# Altium schematic sheet turnsig2.SchDoc
size A4
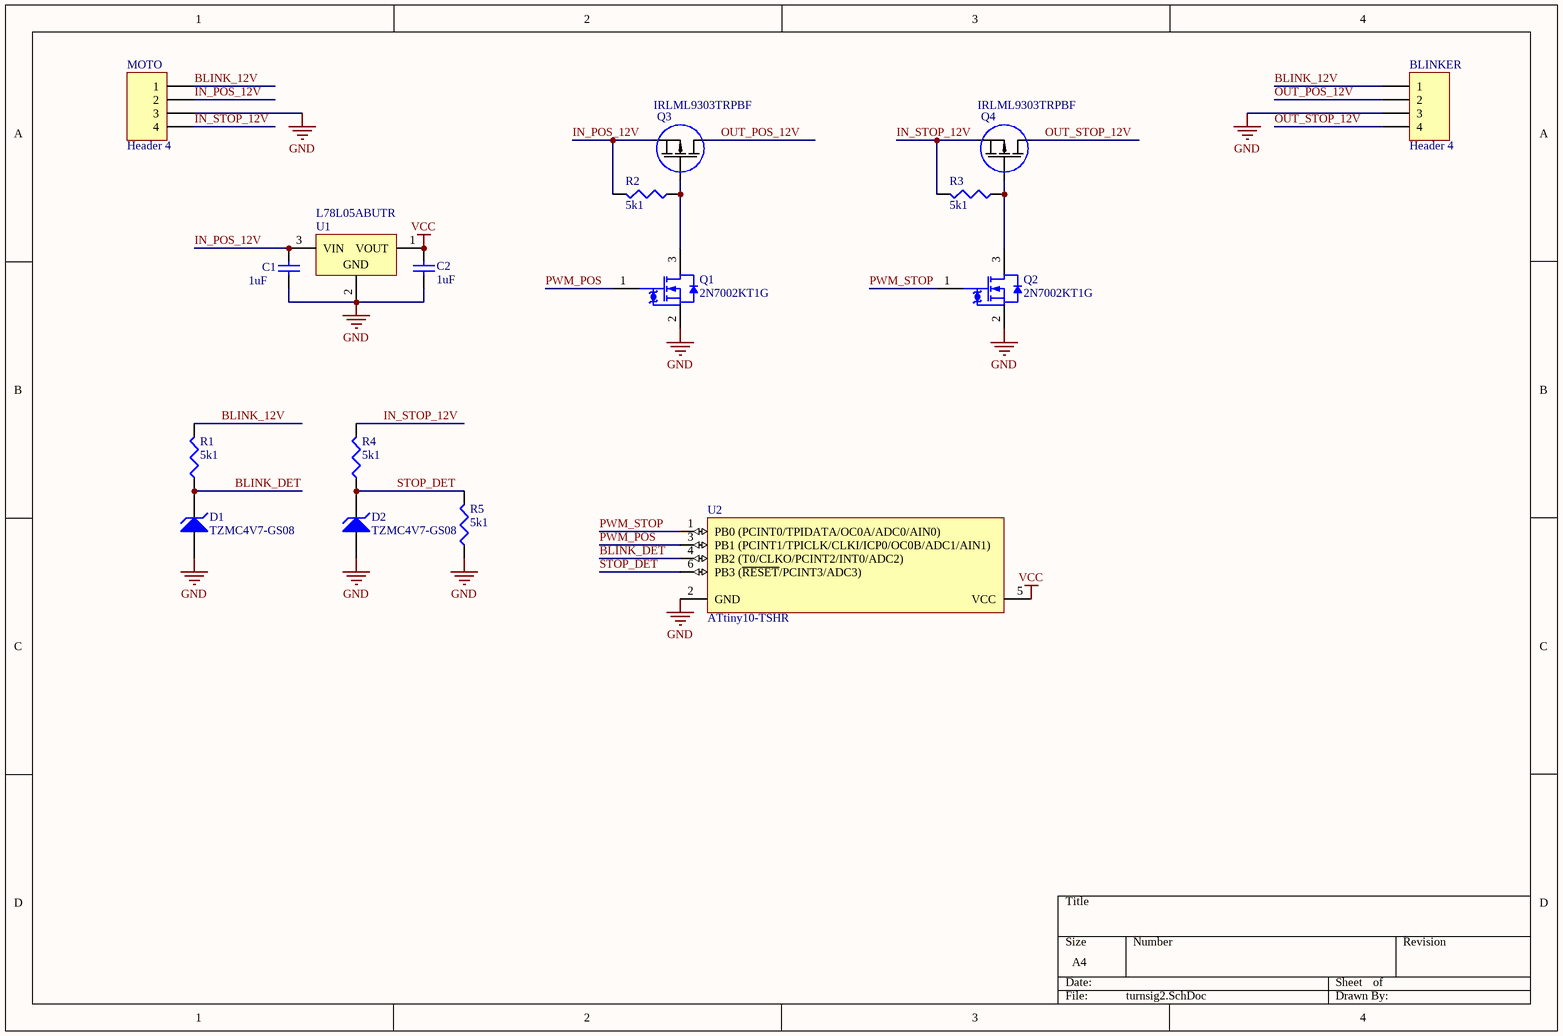
[diagram p0: turnsig2.SchDoc]

## Parts
BLINKER  Header 4  [wireheader]  (no BOM)
C1  value 1uF  [1608[0603]]  (hidden comment: Cap Semi)
C2  value 1uF  [1608[0603]]  (hidden comment: Cap Semi)
D1  TZMC4V7-GS08  [SOD-80/MLL34]
D2  TZMC4V7-GS08  [SOD-80/MLL34]
MOTO  Header 4  [wireheader]  (no BOM)
Q1  2N7002KT1G  [ONSC-SOT-23-3-318-08_V]
Q2  2N7002KT1G  [ONSC-SOT-23-3-318-08_V]
Q3  IRLML9303TRPBF  [SOT23-3N]
Q4  IRLML9303TRPBF  [SOT23-3N]
R1  value 5k1  [J1-0603]  (hidden comment: Res3)
R2  value 5k1  [J1-0603]  (hidden comment: Res3)
R3  value 5k1  [J1-0603]  (hidden comment: Res3)
R4  value 5k1  [J1-0603]  (hidden comment: Res3)
R5  value 5k1  [J1-0603]  (hidden comment: Res3)
U1  L78L05ABUTR  [SOT-89_N]
U2  ATtiny10-TSHR  [6ST1_N]

## Nets
GND: BLINKER.3 C1.2 C2.2 D1.1(A) D2.1(A) MOTO.3 Q1.2(S) Q2.2(S) R5.1 U1.2(GND) U2.2(GND)
VCC: C2.1 U1.1(VOUT) U2.5(VCC)
BLINK_12V: BLINKER.1 MOTO.1 R1.2
BLINK_DET: D1.2(K) R1.1 U2.4(PB2_(T0/CLKO/PCINT2/INT0/ADC2))
IN_POS_12V: C1.1 MOTO.2 Q3.2(S) R2.2 U1.3(VIN)
IN_STOP_12V: MOTO.4 Q4.2(S) R3.2 R4.2
OUT_POS_12V: BLINKER.2 Q3.3(D)
OUT_STOP_12V: BLINKER.4 Q4.3(D)
PWM_POS: Q1.1(G) U2.3(PB1_(PCINT1/TPICLK/CLKI/ICP0/OC0B/ADC1/AIN1))
PWM_STOP: Q2.1(G) U2.1(PB0_(PCINT0/TPIDATA/OC0A/ADC0/AIN0))
STOP_DET: D2.2(K) R4.1 R5.2 U2.6(PB3_(~{RESET}/PCINT3/ADC3))
NetQ1_3: Q1.3(D) Q3.1(G) R2.1
NetQ2_3: Q2.3(D) Q4.1(G) R3.1

## Library data of the parts
BLINKER MOTO = Header 4: Header, 4-Pin; LatestRevisionDate: 17-Jul-2002; LatestRevisionNote: Re-released for DXP Platform.; Publisher: Altium Limited
C1 C2 = Cap Semi: Capacitor (Semiconductor SIM Model); Published: 8-Jun-2000; LatestRevisionDate: 29-May-2009; LatestRevisionNote: IPC-7351 Footprint Added.; PackageReference: C1206; Publisher: Altium Limited; PackageDescription: Chip Capacitor; Supplier 1: TME; Supplier Part Number 1: CL10A105KA8NNNC
D1 D2 = D Zener: Voltage: 4V7; Published: 8-Jun-2000; LatestRevisionDate: 17-Jul-2002; LatestRevisionNote: Re-released for DXP Platform.; PackageReference: DIODE-0.7; Publisher: Altium Limited; PackageDescription: Diode, Thru-Hole; 2 Leads; 0.7 in Pin Spacing; Supplier 1: TME; Supplier Part Number 1: TZMC4V7-GS08
Q1 Q2 = 2N7002KT1G: Small Signal MOSFET, 60 V, 380 mA, Single, N-Channel, 3-Pin SOT-23, Pb-Free, Tape and Reel; Manufacturer: On Semiconductor; Channel Polarity: N Channel; Ciss Typ (pF): 24.5; Coss Typ (pF): 4.2; Crss Typ (pF): 2.2; ID Max (A): 0.38; V(BR)DSS Min (V): 60; VGS Max (V): 20; VGS(th) Max (V): 2.3; DatasheetVersion: Rev. 11; PackageVersion: Rev. AP, 11/2009; PackageReference: SOT-23-3-318-08; PackageDescription: 3-Pin Small Outline Transistor, Body 2.92 x 1.3 mm, Pitch 0.95 mm; Supplier 1: Digi-Key; Supplier Part Number 1: 2N7002KT1GOSCT-ND; Supplier 2: Digi-Key; Supplier Part Number 2: 2N7002KT1GOSDKR-ND; Supplier 3: Farnell; Supplier Part Number 3: 2317619; Supplier 4: Farnell; Supplier Part Number 4: 2317894; Supplier 5: Newark; Supplier Part Number 5: 50M6388; Supplier 6: Newark; Supplier Part Number 6: 09R9863; Supplier 7: Mouser; Supplier Part Number 7: 863-2N7002KT1G; Configuration: Single; Package Type: SOT-23-3; Packing: Tape and Reel; RoHS: Pb-Free; Mounting Technology: Surface Mount; PartNumber: 2N7002KT1G; ComponentLink1Description: Manufacturer URL; ComponentLink1URL: http://www.onsemi.com/; ComponentLink2Description: Datasheet; ComponentLink2URL: http://www.onsemi.com/pub_link/Collateral/2N7002K-D.PDF; ComponentLink3Description: Package Specification; ComponentLink3URL: http://www.onsemi.cn/pub_link/Collateral/318-08.PDF; Supplier 8: TME; Supplier Part Number 8: 2N7002KT1G
Q3 Q4 = SI2323DS: MOSFET-P; Supplier 1: TME; Supplier Part Number 1: IRLML9303TRPBF
R1-R5 = Res3: Resistor; Published: 8-Jun-2000; LatestRevisionDate: 29-May-2009; LatestRevisionNote: IPC-7351 Footprint Added.; PackageReference: J1-0603; Publisher: Altium Limited; PackageDescription: Chip Resistor; Supplier 1: TME; Supplier Part Number 1: SMD0603-5K1
U1 = L78L05ABUTR: Positive Voltage Regulator, 5V, 4-Pin SOT-89, Tape and Reel; DatasheetVersion: Feb-2011; PackageVersion: 2011; PackageReference: SOT-89; PackageDescription: 3-Pin SOT-89 Package 1.5 mm Pitch, 4.1 mm Lead Span; PartNumber: L78L05ABUTR; ComponentLink1Description: Manufacturer URL; ComponentLink1URL: http://www.st.com; ComponentLink2Description: Datasheet; ComponentLink2URL: http://www.st.com/internet/com/TECHNICAL_RESOURCES/TECHNICAL_LITERATURE/DATASHEET/CD00000446.pdf; Supplier 1: TME; Supplier Part Number 1: L78L05ABU
U2 = ATtiny10-TSHR: 8-bit AVR Microcontroller, 1.8-5.5V, 1KB Flash, 32 Bytes SRAM, ADC, 6-pin SOT-23, Industrial (-40°C to 85°C), Pb-Free, Reel; Published: 1-Apr-2010; DatasheetVersion: revD, Feb-2010; PackageVersion: revA, Jun-2008; PackageReference: 6ST1; Publisher: Altium Limited; PackageDescription: 6-Lead, 2.90 x 1.60 mm Plastic Small Outline Package (SOT23); Supplier 1: Digi-Key; Supplier Part Number 1: ATTINY10-TSHRCT-ND; Supplier 2: Digi-Key; Supplier Part Number 2: ATTINY10-TSHRDKR-ND; Supplier 3: Farnell; Supplier Part Number 3: 1748538; Supplier 4: Mouser; Supplier Part Number 4: 556-ATTINY10-TSHR; Code_JEDEC: MO-178-AB; Code_IPC: SOT26A-6; ComponentLink1Description: Manufacturer Link; ComponentLink1URL: http://www.atmel.com/products/avr/default.asp?; ComponentLink2Description: ATtiny4/5/9/10 Datasheet; ComponentLink2URL: http://www.atmel.com/dyn/resources/prod_documents/doc8127.pdf; ComponentLink3Description: ATtiny4/5/9/10 Summary; ComponentLink3URL: http://www.atmel.com/dyn/resources/prod_documents/8127S.pdf; ComponentLink4Description: Atmel.com Home; ComponentLink4URL: http://www.atmel.com; Supplier 5: TME; Supplier Part Number 5: ATTINY10-TSHR